# EAGLE design break_dancer (EAGLE 5.03)
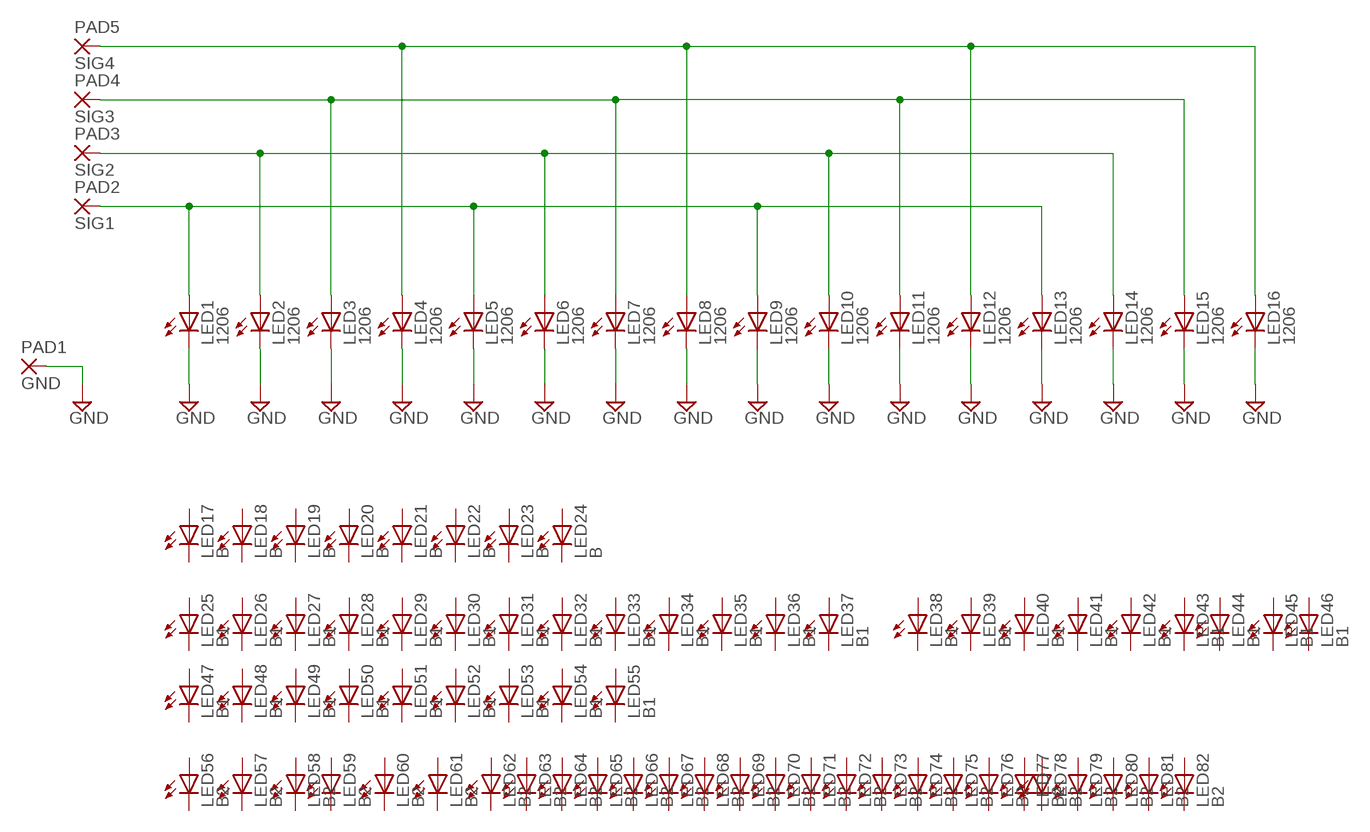
[diagram p0: schematic, sheet 1]

## Parts
LED1  1206  LEDCHIPLED_1206  [CHIPLED_1206]
LED2  1206  LEDCHIPLED_1206  [CHIPLED_1206]
LED3  1206  LEDCHIPLED_1206  [CHIPLED_1206]
LED4  1206  LEDCHIPLED_1206  [CHIPLED_1206]
LED5  1206  LEDCHIPLED_1206  [CHIPLED_1206]
LED6  1206  LEDCHIPLED_1206  [CHIPLED_1206]
LED7  1206  LEDCHIPLED_1206  [CHIPLED_1206]
LED8  1206  LEDCHIPLED_1206  [CHIPLED_1206]
LED9  1206  LEDCHIPLED_1206  [CHIPLED_1206]
LED10  1206  LEDCHIPLED_1206  [CHIPLED_1206]
LED11  1206  LEDCHIPLED_1206  [CHIPLED_1206]
LED12  1206  LEDCHIPLED_1206  [CHIPLED_1206]
LED13  1206  LEDCHIPLED_1206  [CHIPLED_1206]
LED14  1206  LEDCHIPLED_1206  [CHIPLED_1206]
LED15  1206  LEDCHIPLED_1206  [CHIPLED_1206]
LED16  1206  LEDCHIPLED_1206  [CHIPLED_1206]
LED17  B  LEDCHIPLED_1206  [CHIPLED_1206]
LED18  B  LEDCHIPLED_1206  [CHIPLED_1206]
LED19  B  LEDCHIPLED_1206  [CHIPLED_1206]
LED20  B  LEDCHIPLED_1206  [CHIPLED_1206]
LED21  B  LEDCHIPLED_1206  [CHIPLED_1206]
LED22  B  LEDCHIPLED_1206  [CHIPLED_1206]
LED23  B  LEDCHIPLED_1206  [CHIPLED_1206]
LED24  B  LEDCHIPLED_1206  [CHIPLED_1206]
LED25  B1  LEDCHIPLED_0805  [CHIPLED_0805]
LED26  B1  LEDCHIPLED_0805  [CHIPLED_0805]
LED27  B1  LEDCHIPLED_0805  [CHIPLED_0805]
LED28  B1  LEDCHIPLED_0805  [CHIPLED_0805]
LED29  B1  LEDCHIPLED_0805  [CHIPLED_0805]
LED30  B1  LEDCHIPLED_0805  [CHIPLED_0805]
LED31  B1  LEDCHIPLED_0805  [CHIPLED_0805]
LED32  B1  LEDCHIPLED_0805  [CHIPLED_0805]
LED33  B1  LEDCHIPLED_0805  [CHIPLED_0805]
LED34  B1  LEDCHIPLED_0805  [CHIPLED_0805]
LED35  B1  LEDCHIPLED_0805  [CHIPLED_0805]
LED36  B1  LEDCHIPLED_0805  [CHIPLED_0805]
LED37  B1  LEDCHIPLED_0805  [CHIPLED_0805]
LED38  B1  LEDCHIPLED_0805  [CHIPLED_0805]
LED39  B1  LEDCHIPLED_0805  [CHIPLED_0805]
LED40  B1  LEDCHIPLED_0805  [CHIPLED_0805]
LED41  B1  LEDCHIPLED_0805  [CHIPLED_0805]
LED42  B1  LEDCHIPLED_0805  [CHIPLED_0805]
LED43  B1  LEDCHIPLED_0805  [CHIPLED_0805]
LED44  B1  LEDCHIPLED_0805  [CHIPLED_0805]
LED45  B1  LEDCHIPLED_0805  [CHIPLED_0805]
LED46  B1  LEDCHIPLED_0805  [CHIPLED_0805]
LED47  B1  LEDCHIPLED_0805  [CHIPLED_0805]
LED48  B1  LEDCHIPLED_0805  [CHIPLED_0805]
LED49  B1  LEDCHIPLED_0805  [CHIPLED_0805]
LED50  B1  LEDCHIPLED_0805  [CHIPLED_0805]
LED51  B1  LEDCHIPLED_0805  [CHIPLED_0805]
LED52  B1  LEDCHIPLED_0805  [CHIPLED_0805]
LED53  B1  LEDCHIPLED_0805  [CHIPLED_0805]
LED54  B1  LEDCHIPLED_0805  [CHIPLED_0805]
LED55  B1  LEDCHIPLED_0805  [CHIPLED_0805]
LED56  B2  LEDCHIPLED_0603  [CHIPLED_0603]
LED57  B2  LEDCHIPLED_0603  [CHIPLED_0603]
LED58  B2  LEDCHIPLED_0603  [CHIPLED_0603]
LED59  B2  LEDCHIPLED_0603  [CHIPLED_0603]
LED60  B2  LEDCHIPLED_0603  [CHIPLED_0603]
LED61  B2  LEDCHIPLED_0603  [CHIPLED_0603]
LED62  B2  LEDCHIPLED_0603  [CHIPLED_0603]
LED63  B2  LEDCHIPLED_0603  [CHIPLED_0603]
LED64  B2  LEDCHIPLED_0603  [CHIPLED_0603]
LED65  B2  LEDCHIPLED_0603  [CHIPLED_0603]
LED66  B2  LEDCHIPLED_0603  [CHIPLED_0603]
LED67  B2  LEDCHIPLED_0603  [CHIPLED_0603]
LED68  B2  LEDCHIPLED_0603  [CHIPLED_0603]
LED69  B2  LEDCHIPLED_0603  [CHIPLED_0603]
LED70  B2  LEDCHIPLED_0603  [CHIPLED_0603]
LED71  B2  LEDCHIPLED_0603  [CHIPLED_0603]
LED72  B2  LEDCHIPLED_0603  [CHIPLED_0603]
LED73  B2  LEDCHIPLED_0603  [CHIPLED_0603]
LED74  B2  LEDCHIPLED_0603  [CHIPLED_0603]
LED75  B2  LEDCHIPLED_0603  [CHIPLED_0603]
LED76  B2  LEDCHIPLED_0603  [CHIPLED_0603]
LED77  B2  LEDCHIPLED_0603  [CHIPLED_0603]
LED78  B2  LEDCHIPLED_0603  [CHIPLED_0603]
LED79  B2  LEDCHIPLED_0603  [CHIPLED_0603]
LED80  B2  LEDCHIPLED_0603  [CHIPLED_0603]
LED81  B2  LEDCHIPLED_0603  [CHIPLED_0603]
LED82  B2  LEDCHIPLED_0603  [CHIPLED_0603]
PAD1  GND  SMD2  [SMD1,27-2,54]
PAD2  SIG1  SMD2  [SMD1,27-2,54]
PAD3  SIG2  SMD2  [SMD1,27-2,54]
PAD4  SIG3  SMD2  [SMD1,27-2,54]
PAD5  SIG4  SMD2  [SMD1,27-2,54]

## Nets
GND: LED1.C LED2.C LED3.C LED4.C LED5.C LED6.C LED7.C LED8.C LED9.C LED10.C LED11.C LED12.C LED13.C LED14.C LED15.C LED16.C PAD1.1(P)
N$3: LED1.A LED5.A LED9.A LED13.A PAD2.1(P)
N$4: LED2.A LED6.A LED10.A LED14.A PAD3.1(P)
N$5: LED3.A LED7.A LED11.A LED15.A PAD4.1(P)
N$6: LED4.A LED8.A LED12.A LED16.A PAD5.1(P)
Unconnected: LED17.A LED17.C LED18.A LED18.C LED19.A LED19.C LED20.A LED20.C LED21.A LED21.C LED22.A LED22.C LED23.A LED23.C LED24.A LED24.C LED25.A LED25.C LED26.A LED26.C LED27.A LED27.C LED28.A LED28.C LED29.A LED29.C LED30.A LED30.C LED31.A LED31.C LED32.A LED32.C LED33.A LED33.C LED34.A LED34.C LED35.A LED35.C LED36.A LED36.C LED37.A LED37.C LED38.A LED38.C LED39.A LED39.C LED40.A LED40.C LED41.A LED41.C LED42.A LED42.C LED43.A LED43.C LED44.A LED44.C LED45.A LED45.C LED46.A LED46.C LED47.A LED47.C LED48.A LED48.C LED49.A LED49.C LED50.A LED50.C LED51.A LED51.C LED52.A LED52.C LED53.A LED53.C LED54.A LED54.C LED55.A LED55.C LED56.A LED56.C LED57.A LED57.C LED58.A LED58.C LED59.A LED59.C LED60.A LED60.C LED61.A LED61.C LED62.A LED62.C LED63.A LED63.C LED64.A LED64.C LED65.A LED65.C LED66.A LED66.C LED67.A LED67.C LED68.A LED68.C LED69.A LED69.C LED70.A LED70.C LED71.A LED71.C LED72.A LED72.C LED73.A LED73.C LED74.A LED74.C LED75.A LED75.C LED76.A LED76.C LED77.A LED77.C LED78.A LED78.C LED79.A LED79.C LED80.A LED80.C LED81.A LED81.C LED82.A LED82.C

## Library data of the parts
LED1-LED82 = led:LED: LED OSRAM: - CHIPLED LG R971, LG N971, LY N971, LG Q971, LY Q971, LO R971, LY R971 LH N974, LH R974 LS Q976, LO Q976, LY Q976 LO Q996 - Hyper CHIPLED LW Q18S LB Q993, LB Q99A, LB R99A - SideLED LS A670, LO A670, LY A670, LG A670, LP A670 LB A673, LV A673, LT A673, LW A673 LH A674 LY A675 LS A676, LA A676, LO A676, LY A676, LW A676 LS A679, LY A679, LG A679 - Hyper Micro SIDELED® LS Y876, LA Y876, LO Y876, LY Y876 LT Y87S - SmartLED LW L88C, LW L88S LB L89C, LB L89S, LG L890 LS L89K, LO L89K, LY L89K LS L896, LA L896, LO L896, LY L896 - TOPLED LS T670, LO T670, LY T670, LG T670, LP T670 LSG T670, LSP T670, LSY T670, LOP T670, LYG T670 LG T671, LOG T671, LSG T671 LB T673, LV T673, LT T673, LW T673 LH T674 LS T676, LA T676, LO T676, LY T676, LB T676, LH T676, LSB T676, LW T676 LB T67C, LV T67C, LT T67C, LS T67K, LO T67K, LY T67K, LW E67C LS E67B, LA E67B, LO E67B, LY E67B, LB E67C, LV E67C, LT E67C LW T67C LS T679, LY T679, LG T679 LS T770, LO T770, LY T770, LG T770, LP T770 LB T773, LV T773, LT T773, LW T773 LH T774 LS E675, LA E675, LY E675, LS T675 LS T776, LA T776, LO T776, LY T776, LB T776 LHGB T686 LT T68C, LB T68C - Hyper Mini TOPLED® LB M676 - Mini TOPLED Santana® LG M470 LS M47K, LO M47K, LY M47K Source: http://www.osram.convergy.de LUXEON: - LUMILED® LXK2-PW12-R00, LXK2-PW12-S00, LXK2-PW14-U00, LXK2-PW14-V00 LXK2-PM12-R00, LXK2-PM12-S00, LXK2-PM14-U00 LXK2-PE12-Q00, LXK2-PE12-R00, LXK2-PE12-S00, LXK2-PE14-T00, LXK2-PE14-U00 LXK2-PB12-K00, LXK2-PB12-L00, LXK2-PB12-M00, LXK2-PB14-N00, LXK2-PB14-P00, LXK2-PB14-Q00 LXK2-PR12-L00, LXK2-PR12-M00, LXK2-PR14-Q00, LXK2-PR14-R00 LXK2-PD12-Q00, LXK2-PD12-R00, LXK2-PD12-S00 LXK2-PH12-R00, LXK2-PH12-S00 LXK2-PL12-P00, LXK2-PL12-Q00, LXK2-PL12-R00 Source: www.luxeon.com KINGBRIGHT: KA-3528ASYC Source: www.kingbright.com
PAD1-PAD5 = wirepad:SMD2: SMD PAD

## Board
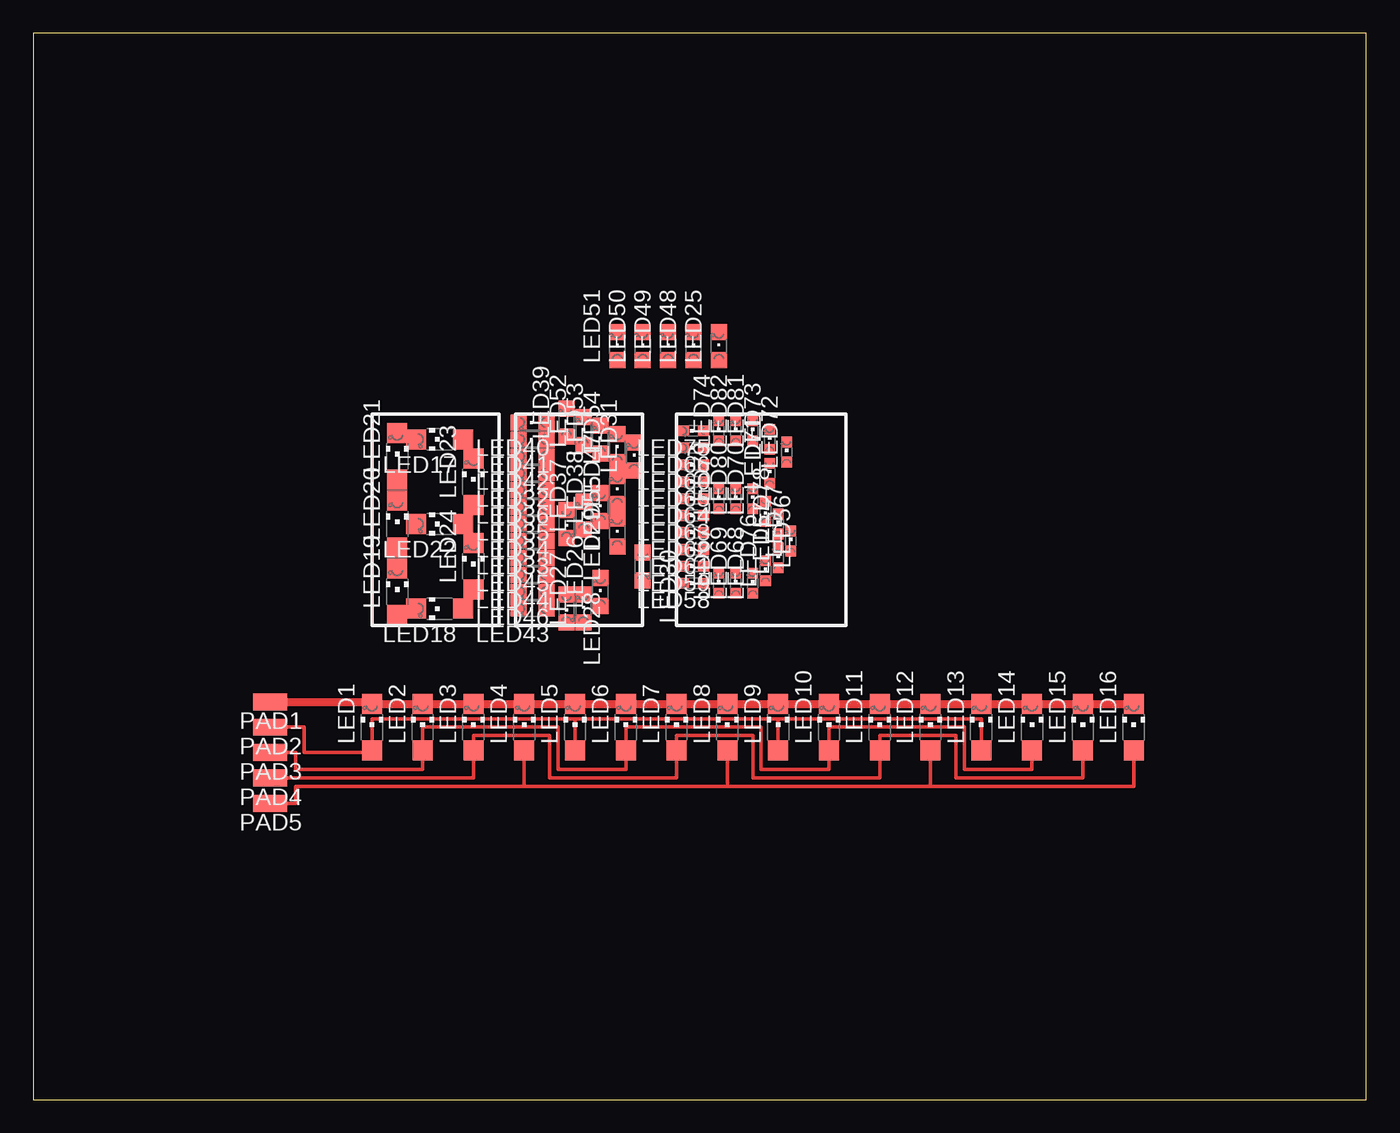
[diagram p1: board, top side]

Size 100 x 80 mm. Coordinates in mm from the lower left corner, seen from the top.
Outline: 0,0 100,0 100,80 0,80 0,0
Copper layers (1*16): Top 0.035mm / dielectric 1.5mm / Bottom 0.035mm
Design rules "default": minimum track width 10mil, minimum drill 24mil, track to track 8mil, track to pad 8mil, pad to pad 8mil, via to via 8mil, smd to smd 8mil, copper to edge 40mil, drill to drill 8mil, minimum pad ring 10mil, minimum via ring 8mil, stop-mask expansion 4mil, vias tented up to drill 0mil, thermal gap 10mil

### Footprints (pad centres in the part's own frame; a part is rotated, then mirrored left to right if it is on the bottom)
CHIPLED_1206 = smd 1.5 x 1.5: A 0,-1.75; C 0,1.75
CHIPLED_0805 = smd 1.2 x 1.2: A 0,-1.05; C 0,1.05
CHIPLED_0603 = smd 0.8 x 0.8: A 0,-0.75; C 0,0.75
SMD1,27-2,54 = smd 1.27 x 2.54: 1 0,0

### Placement (x,y rotation side)
LED1  25.4,27.94 0 top
LED2  29.21,27.94 0 top
LED3  33.02,27.94 0 top
LED4  36.83,27.94 0 top
LED5  40.64,27.94 0 top
LED6  44.45,27.94 0 top
LED7  48.26,27.94 0 top
LED8  52.07,27.94 0 top
LED9  55.88,27.94 0 top
LED10  59.69,27.94 0 top
LED11  63.5,27.94 0 top
LED12  67.31,27.94 0 top
LED13  71.12,27.94 0 top
LED14  74.93,27.94 0 top
LED15  78.74,27.94 0 top
LED16  82.55,27.94 0 top
LED17  30.48,49.53 90 top
LED18  30.48,36.83 90 top
LED19  27.3,38.1 0 top
LED20  27.3,43.18 0 top
LED21  27.3,48.26 0 top
LED22  30.48,43.18 90 top
LED23  33.02,46.35 0 top
LED24  33.02,40.01 0 top
LED25  51.44,56.52 0 top
LED26  42.55,38.1 0 top
LED27  41.27,36.83 0 top
LED28  40.01,36.83 180 top
LED29  40.01,43.18 180 top
LED30  45.72,40.01 180 top
LED31  45.09,48.26 0 top
LED32  37.47,46.99 90 top
LED33  37.47,41.91 90 top
LED34  37.47,43.18 90 top
LED35  37.47,44.45 90 top
LED36  37.47,45.72 90 top
LED37  41.27,43.81 0 top
LED38  42.55,44.45 0 top
LED39  40.01,50.8 0 top
LED40  37.47,50.8 90 top
LED41  37.47,49.53 90 top
LED42  37.47,48.26 90 top
LED43  37.47,36.83 90 top
LED44  37.47,39.37 90 top
LED45  37.47,40.64 90 top
LED46  37.47,38.1 90 top
LED47  43.81,45.72 0 top
LED48  49.53,56.52 0 top
LED49  47.62,56.52 0 top
LED50  45.72,56.52 0 top
LED51  43.81,56.52 0 top
LED52  41.27,50.16 0 top
LED53  42.55,49.53 0 top
LED54  43.81,48.9 0 top
LED55  43.81,42.55 0 top
LED56  54.93,44.13 180 top
LED57  55.88,40.64 0 top
LED58  49.53,38.73 90 top
LED59  49.53,40.01 90 top
LED60  49.53,47.62 90 top
LED61  49.53,41.27 90 top
LED62  49.53,42.55 90 top
LED63  49.53,43.81 90 top
LED64  49.53,45.09 90 top
LED65  49.53,46.35 90 top
LED66  49.53,48.9 90 top
LED67  51.44,38.73 0 top
LED68  53.98,38.73 0 top
LED69  52.7,38.73 0 top
LED70  53.98,45.09 0 top
LED71  55.24,46.99 0 top
LED72  56.52,48.58 0 top
LED73  55.24,49.53 0 top
LED74  51.44,50.16 0 top
LED75  49.53,50.16 90 top
LED76  54.93,39.69 0 top
LED77  56.83,41.91 0 top
LED78  55.88,43.18 0 top
LED79  51.44,45.09 0 top
LED80  52.7,45.09 0 top
LED81  53.98,50.16 0 top
LED82  52.7,50.16 0 top
PAD1  17.78,29.84 90 top
PAD2  17.78,27.94 90 top
PAD3  17.78,26.04 90 top
PAD4  17.78,24.13 90 top
PAD5  17.78,22.23 90 top

### Tracks (layer width: path | path; a pad name or v marks a point on that pad's centre or on a via)
GND
  Top 0.61: PAD1.1 25.4,29.84 LED1.C LED2.C LED3.C LED4.C LED5.C LED6.C LED7.C LED8.C LED9.C LED10.C LED11.C LED12.C LED13.C LED14.C LED15.C LED16.C
N$3
  Top 0.254: 40.64,28.57 25.4,28.57 LED1.A 25.4,26.04 20.32,26.04 20.32,27.94 PAD2.1 | 40.64,28.57 55.88,28.57 | 55.88,28.57 LED9.A | LED13.A 71.12,28.57 55.88,28.57 | 40.64,28.57 LED5.A
N$4
  Top 0.254: LED14.A 74.93,24.77 69.85,24.77 69.85,27.94 59.69,27.94 LED10.A 59.69,24.77 54.61,24.77 54.61,27.94 44.45,27.94 LED6.A 44.45,24.77 39.37,24.77 39.37,27.94 29.21,27.94 LED2.A 29.21,24.77 19.68,24.77 19.68,26.04 PAD3.1
N$5
  Top 0.254: PAD4.1 33.02,24.13 LED3.A 33.02,27.3 38.73,27.3 38.73,24.13 48.26,24.13 LED7.A 48.26,27.3 53.98,27.3 53.98,24.13 63.5,24.13 LED11.A 63.5,27.3 69.22,27.3 69.22,24.13 78.74,24.13 LED15.A
N$6
  Top 0.254: PAD5.1 19.68,22.23 19.68,23.5 36.83,23.5 | 36.83,23.5 LED4.A | 52.07,23.5 LED8.A | 67.31,23.5 LED12.A | LED16.A 82.55,23.5 67.31,23.5 | 36.83,23.5 52.07,23.5 | 52.07,23.5 67.31,23.5